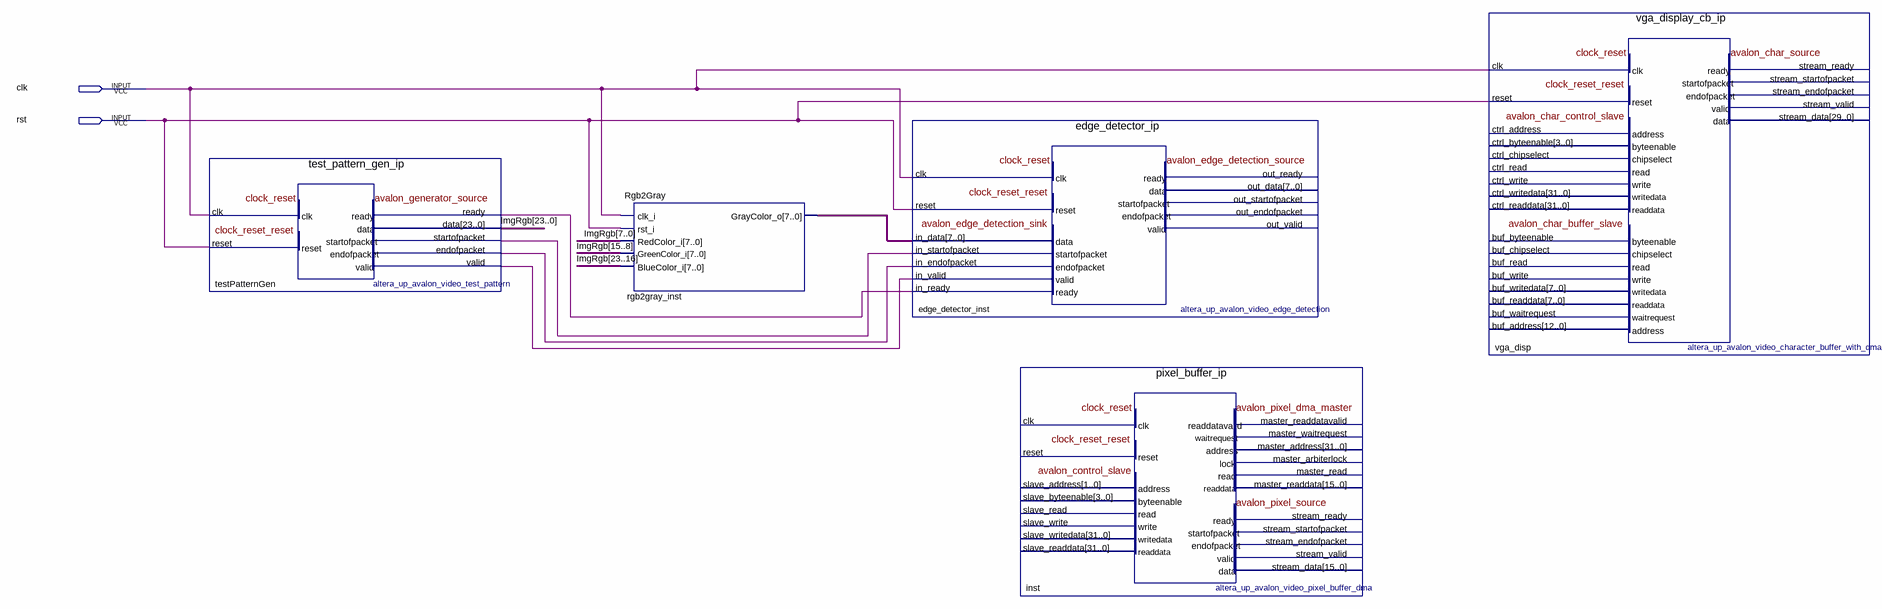
[diagram p0: schematic sheet]
// Quartus schematic edge_detection_with_ip_core.bdf as structural Verilog: 5 symbols, 2 pins
module edge_detection_with_ip_core (
  input  clk,
  input  rst
);

  wire edge_detector_inst_in_ready, testPatternGen_endofpacket, testPatternGen_startofpacket,
       testPatternGen_valid;
  wire [7:0] rgb2gray_inst_graycolor_o;
  wire [23:0] ImgRgb;

  test_pattern_gen_ip testPatternGen (
    .clk(clk), .reset(rst), .ready(edge_detector_inst_in_ready), .data(ImgRgb),
    .startofpacket(testPatternGen_startofpacket), .endofpacket(testPatternGen_endofpacket),
    .valid(testPatternGen_valid));
  Rgb2Gray rgb2gray_inst (
    .clk_i(clk), .rst_i(rst), .RedColor_i(ImgRgb[7:0]), .GreenColor_i(ImgRgb[15:8]),
    .BlueColor_i(ImgRgb[23:16]), .GrayColor_o(rgb2gray_inst_graycolor_o));
  edge_detector_ip edge_detector_inst (
    .clk(clk), .reset(rst), .in_data(rgb2gray_inst_graycolor_o),
    .in_startofpacket(testPatternGen_startofpacket), .in_endofpacket(testPatternGen_endofpacket),
    .in_valid(testPatternGen_valid), .in_ready(edge_detector_inst_in_ready));  // open: out_ready, out_data, out_startofpacket, out_endofpacket, out_valid
  pixel_buffer_ip inst ();  // open: clk, reset, master_readdatavalid, master_waitrequest, master_readdata, slave_address, slave_byteenable, slave_read, slave_write, slave_writedata, stream_ready, master_address, master_arbiterlock, master_read, slave_readdata, stream_startofpacket, stream_endofpacket, stream_valid, stream_data
  vga_display_cb_ip vga_disp (
    .clk(clk), .reset(rst));  // open: ctrl_address, ctrl_byteenable, ctrl_chipselect, ctrl_read, ctrl_write, ctrl_writedata, buf_byteenable, buf_chipselect, buf_read, buf_write, buf_writedata, buf_address, stream_ready, ctrl_readdata, buf_readdata, buf_waitrequest, stream_startofpacket, stream_endofpacket, stream_valid, stream_data
endmodule
